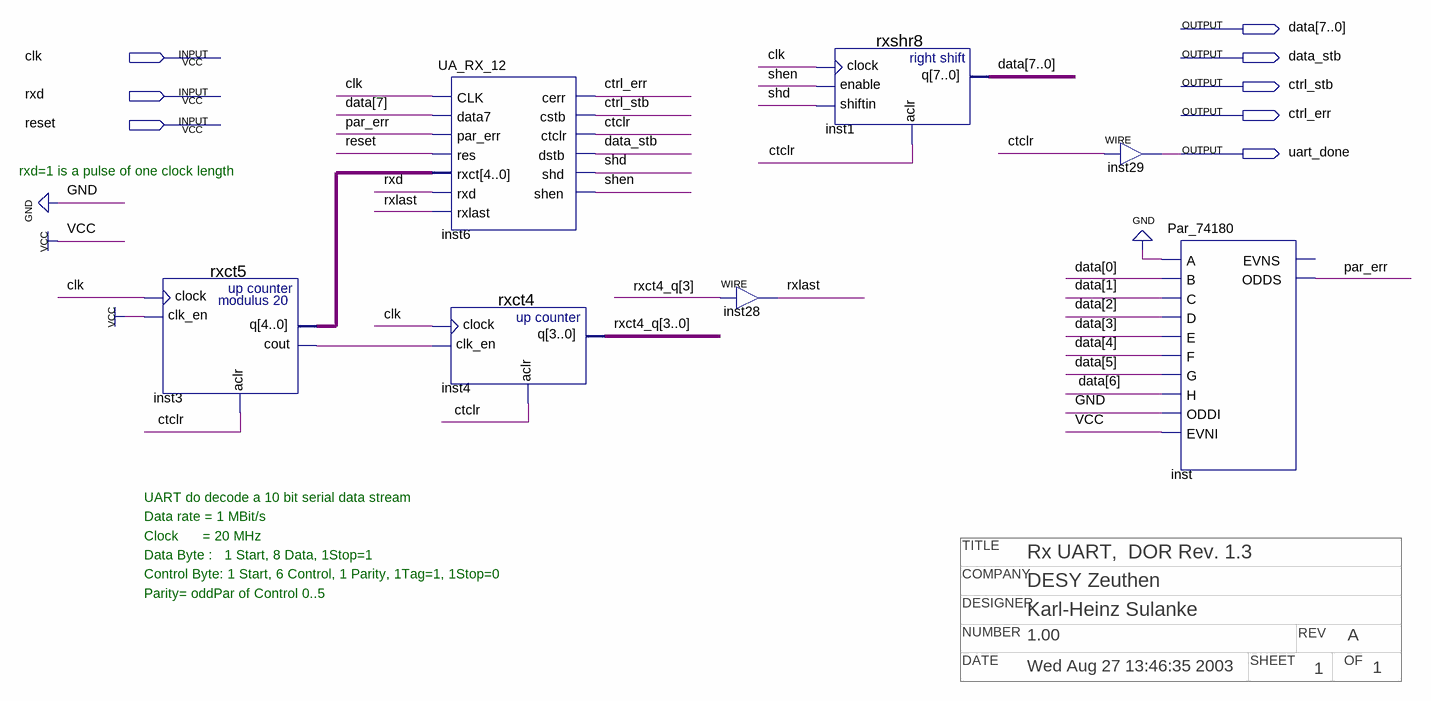
[diagram p0: schematic sheet]
// Quartus schematic RX_UART_12.bdf as structural Verilog: 7 symbols, 8 pins
// Title block: TITLE: Rx UART,  DOR Rev. 1.3; COMPANY: DESY Zeuthen; DESIGNER: Karl-Heinz Sulanke; NUMBER: 1.00; REV: A; DATE: Wed Aug 27 13:46:35 2003; SHEET: 1; OF: 1
module RX_UART_12 (
  input  clk,
  input  rxd,
  input  reset,
  output [7:0] data,
  output data_stb,
  output ctrl_stb,
  output ctrl_err,
  output uart_done
);

  wire ctclr, inst3_cout, par_err, rxlast, shd, shen;
  wire [3:0] rxct4_q;
  wire [4:0] inst3_q;

  rxct5 inst3 (.clock(clk), .clk_en(1'b1), .aclr(ctclr), .q(inst3_q), .cout(inst3_cout));
  UA_RX_12 inst6 (
    .CLK(clk), .data7(data[7]), .par_err(par_err), .res(reset), .rxct(inst3_q), .rxd(rxd), .rxlast(rxlast),
    .cerr(ctrl_err), .cstb(ctrl_stb), .ctclr(ctclr), .dstb(data_stb), .shd(shd), .shen(shen));
  rxct4 inst4 (.clock(clk), .clk_en(inst3_cout), .aclr(ctclr), .q(rxct4_q));
  assign rxlast = rxct4_q[3];  // WIRE inst28
  rxshr8 inst1 (.clock(clk), .enable(shen), .shiftin(shd), .aclr(ctclr), .q(data));
  assign uart_done = ctclr;  // WIRE inst29
  Par_74180 inst (
    .A(1'b0), .B(data[0]), .C(data[1]), .D(data[2]), .E(data[3]), .F(data[4]), .G(data[5]), .H(data[6]),
    .ODDI(1'b0), .EVNI(1'b1), .ODDS(par_err));  // open: EVNS

  // Notes on the sheet:
  //   rxd=1 is a pulse of one clock length
  //   UART do decode a 10 bit serial data stream
  //   Data rate = 1 MBit/s
  //   Clock      = 20 MHz
  //   Data Byte :   1 Start, 8 Data, 1Stop=1
  //   Control Byte: 1 Start, 6 Control, 1 Parity, 1Tag=1, 1Stop=0
  //   Parity= oddPar of Control 0..5
endmodule
